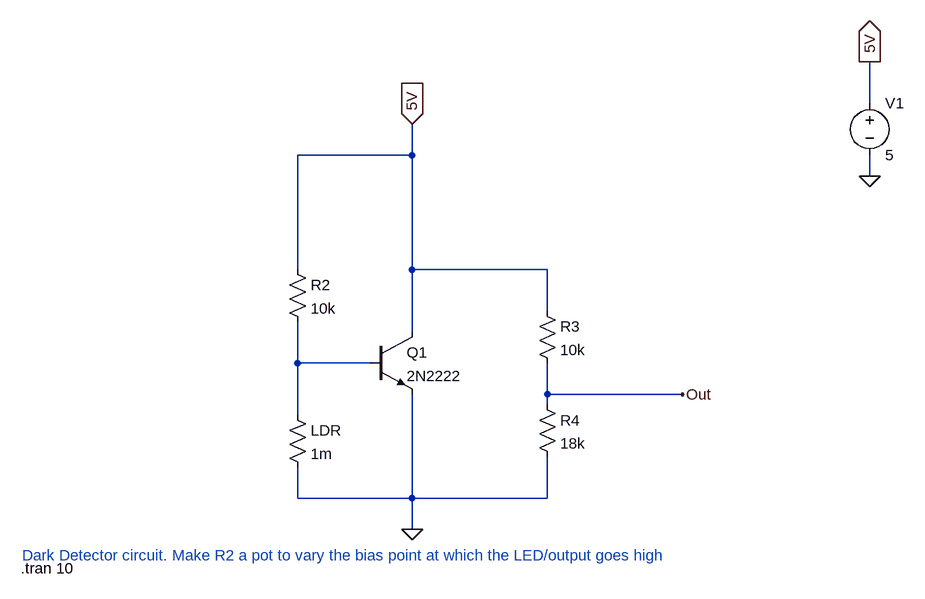
[diagram p0: schematic dark_detector_circuit.asc]
dark_detector_circuit.asc, the LTspice schematic file:
Version 4
SHEET 1 1016 680
WIRE 944 -256 944 -320
WIRE 240 -176 240 -224
WIRE 240 -176 64 -176
WIRE 944 -144 944 -176
WIRE 64 0 64 -176
WIRE 240 0 240 -176
WIRE 448 0 240 0
WIRE 448 64 448 0
WIRE 240 96 240 0
WIRE 64 144 64 80
WIRE 176 144 64 144
WIRE 448 192 448 144
WIRE 656 192 448 192
WIRE 448 208 448 192
WIRE 64 224 64 144
WIRE 64 352 64 304
WIRE 240 352 240 192
WIRE 240 352 64 352
WIRE 448 352 448 288
WIRE 448 352 240 352
WIRE 240 400 240 352
FLAG 240 400 0
FLAG 944 -144 0
FLAG 944 -320 5V
IOPIN 944 -320 Out
FLAG 240 -224 5V
IOPIN 240 -224 In
FLAG 656 192 Out
SYMBOL npn 176 96 R0
SYMATTR InstName Q1
SYMATTR Value 2N2222
SYMBOL res 48 -16 R0
SYMATTR InstName R2
SYMATTR Value 10k
SYMBOL res 48 208 R0
SYMATTR InstName LDR
SYMATTR Value 1m
SYMBOL voltage 944 -272 R0
WINDOW 123 0 0 Left 0
WINDOW 39 0 0 Left 0
SYMATTR InstName V1
SYMATTR Value 5
SYMBOL res 432 48 R0
SYMATTR InstName R3
SYMATTR Value 10k
SYMBOL res 432 192 R0
SYMATTR InstName R4
SYMATTR Value 18k
TEXT -360 440 Left 2 ;Dark Detector circuit. Make R2 a pot to vary the bias point at which the LED/output goes high
TEXT -362 460 Left 2 !.tran 10

The netlist it stands for:
* dark_detector_circuit.asc
Q1 5V N001 0 0 2N2222
R2 5V N001 10k
R§LDR N001 0 1m
V1 5V 0 5
R3 5V Out 10k
R4 Out 0 18k
.model NPN NPN
.model PNP PNP
.lib standard.bjt
* Dark Detector circuit. Make R2 a pot to vary the bias point at which the LED/output goes high
.tran 10
.backanno
.end